# EAGLE design BRUSHLEES (EAGLE 9.6.2)
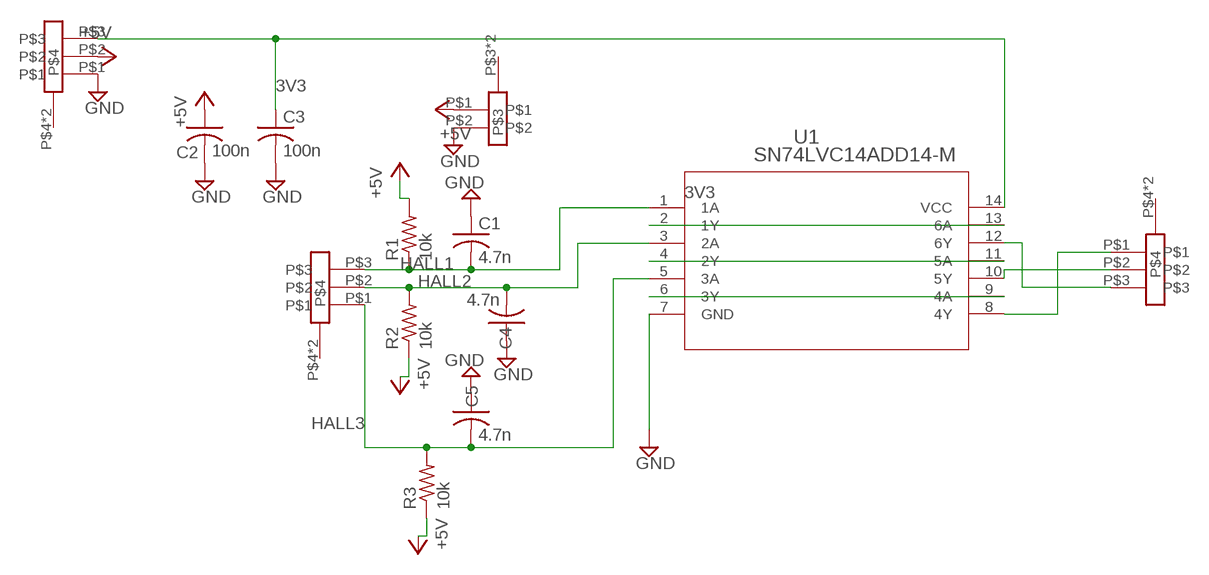
[diagram p0: schematic, sheet 1]

## Parts
ALIMENTACION  PH3  [PH3]
BORN3  PH3  [PH3]
C1  4.7n  C-USC1206K  [C1206K]
C2  100n  C-USC1206K  [C1206K]
C3  100n  C-USC1206K  [C1206K]
C4  4.7n  C-USC1206K  [C1206K]
C5  4.7n  C-USC1206K  [C1206K]
EXT  PH3  [PH3]
R1  10k  R-US_R1206  [R1206]
R2  10k  R-US_R1206  [R1206]
R3  10k  R-US_R1206  [R1206]
U1  SN74LVC14ADD14-M  [D14-M]
U$1  PH2  [PH2]

## Nets
3V3: ALIMENTACION.P$3 C3.1 U1.14(VCC)
+5V: ALIMENTACION.P$2 C2.1 R1.2 R2.1 R3.1 U$1.P$1
GND: ALIMENTACION.P$1 C1.1 C2.2 C3.2 C4.1 C5.1 U1.7(GND) U$1.P$2
HALL1: BORN3.P$3 C1.2 R1.1 U1.1(1A)
HALL2: BORN3.P$2 C4.2 R2.2 U1.3(2A)
HALL3: BORN3.P$1 C5.2 R3.2 U1.5(3A)
N$1: U1.4(2Y) U1.11(5A)
N$2: U1.2(1Y) U1.13(6A)
N$3: U1.6(3Y) U1.9(4A)
N$4: EXT.P$1 U1.8(4Y)
N$5: EXT.P$2 U1.10(5Y)
N$6: EXT.P$3 U1.12(6Y)
Unconnected: ALIMENTACION.P$4 ALIMENTACION.P$5 BORN3.P$4 BORN3.P$5 EXT.P$4 EXT.P$5 U$1.P$3 U$1.P$4

## Library data of the parts
ALIMENTACION BORN3 EXT = MyLib:PH3
C1-C5 = rcl:C-US: CAPACITOR, American symbol; SPICEPREFIX: C
R1-R3 = rcl:R-US_: RESISTOR, American symbol; SPICEPREFIX: R
U1 = RESISTENCIA_MODIFICADA:SN74LVC14AD; COPYRIGHT: Copyright (C) 2024 Ultra Librarian. All rights reserved.; MANUFACTURER_PART_NUMBER: SN74LVC14AD; MFR_NAME: Texas Instruments
U$1 = MyLib:PH2

## Board
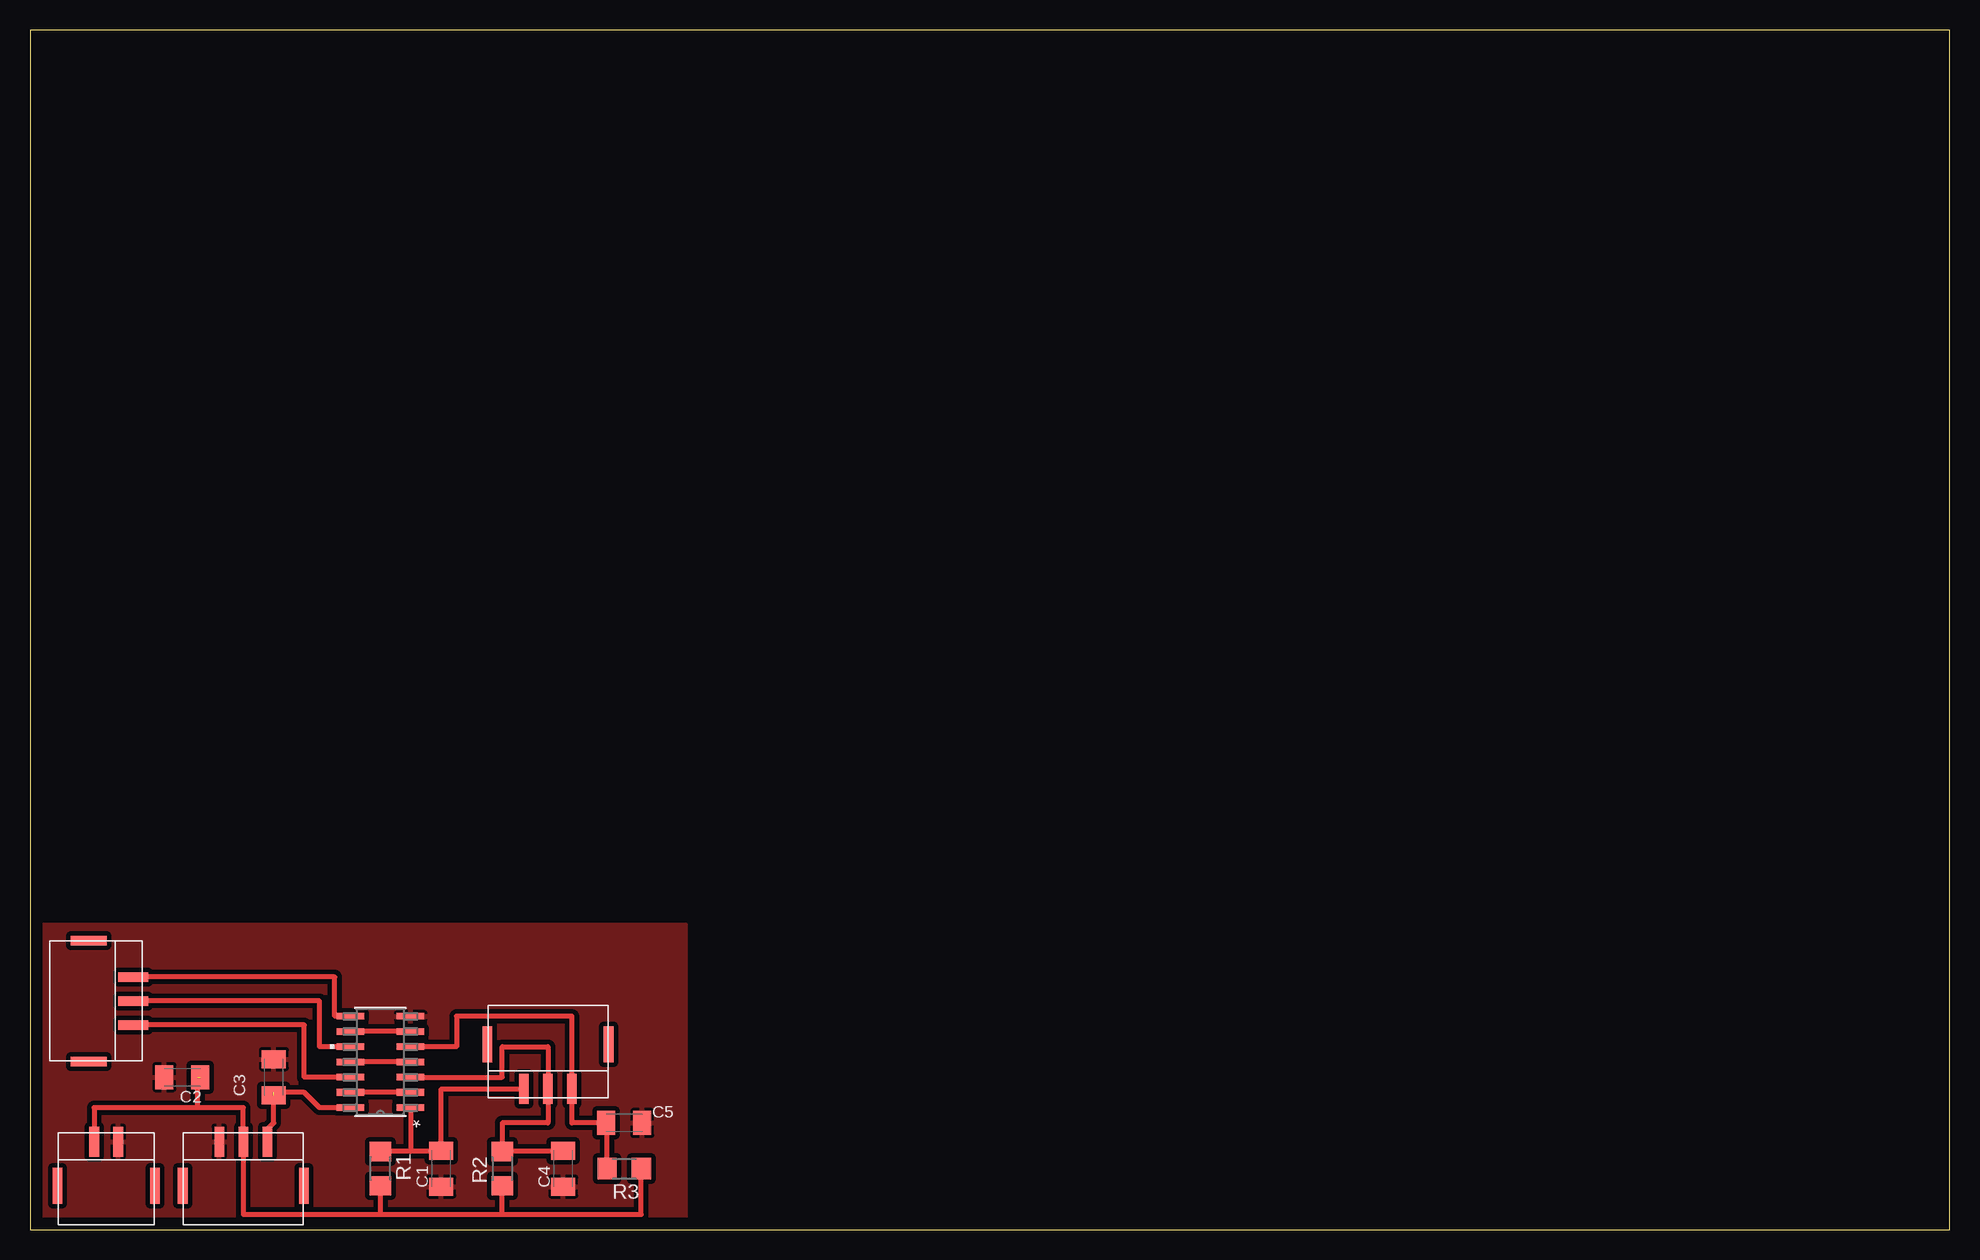
[diagram p1: board, top side]

Size 160 x 100 mm. Coordinates in mm from the lower left corner, seen from the top.
Outline: 0,0 160,0 160,100 0,100 0,0
Copper layers (1*16): Top 0.035mm / dielectric 1.5mm / Bottom 0.035mm
Design rules "default *": minimum track width 6mil, minimum drill 0.35mm, track to track 0.4mm, track to pad 0.4mm, pad to pad 0.4mm, via to via 0.4mm, smd to smd 0.4mm, copper to edge 40mil, drill to drill 6mil, minimum pad ring 10mil, minimum via ring 8mil, stop-mask expansion 4mil, vias tented up to drill 0mil, thermal gap 10mil

### Footprints (pad centres in the part's own frame; a part is rotated, then mirrored left to right if it is on the bottom)
PH3 = smd 0.8 x 2.5: P$1 2,-2.25; P$2 0,-2.25; P$3 -2,-2.25 | smd 0.8 x 3: P$4 -5.05,1.45; P$5 5.05,1.45
C1206K = smd 1.5 x 2: 1 -1.5,0; 2 1.5,0
R1206 = smd 1.6 x 1.803: 1 -1.422,0; 2 1.422,0
D14-M = smd 2.286 x 0.559: 1 -2.515,3.81; 2 -2.515,2.54; 3 -2.515,1.27; 4 -2.515,0; 5 -2.515,-1.27; 6 -2.515,-2.54; 7 -2.515,-3.81; 8 2.515,-3.81; 9 2.515,-2.54; 10 2.515,-1.27; 11 2.515,0; 12 2.515,1.27; 13 2.515,2.54; 14 2.515,3.81
PH2 = smd 0.8 x 2.5: P$1 1,-2.25; P$2 -1,-2.25 | smd 0.8 x 3: P$3 -4.05,1.45; P$4 4.05,1.45

### Placement (x,y rotation side)
ALIMENTACION  17.78,5.08 180 top
BORN3  43.18,13.97 0 top
C1  34.29,5.08 90 top
C2  12.7,12.7 180 top
C3  20.32,12.7 90 top
C4  44.45,5.08 90 top
C5  49.53,8.89 180 top
EXT  6.35,19.05 90 top
R1  29.21,5.08 270 top
R2  39.37,5.08 90 top
R3  49.53,5.08 180 top
U1  29.21,13.97 180 top
U$1  6.35,5.08 180 top

### Tracks (layer width: path | path; a pad name or v marks a point on that pad's centre or on a via)
3V3  (1 unrouted)
  Top 0.406: 19.78,11.43 20.32,11.43 | ALIMENTACION.P$3 19.78,8.35 20.32,8.89 C3.1 20.55,11.43 22.86,11.43 24.13,10.16 U1.14
+5V  (1 unrouted)
  Top 0.406: U$1.P$1 5.35,10.16 13.97,10.16 | 13.97,10.16 17.78,10.16 ALIMENTACION.P$2 17.78,1.27 29.21,1.27 | 13.97,10.16 13.97,12.7 | 29.21,1.27 39.37,1.27 | 39.37,1.27 R2.1 | R3.1 50.95,1.27 39.37,1.27 | 29.21,1.27 R1.2
GND
  pour Top: 0,25.4 54.61,25.4 54.61,1.27 54.61,0 0,0
HALL1
  Top 0.305: 29.21,6.58 R1.1
  Top 0.406: BORN3.P$3 34.29,11.72 C1.2 34.29,6.5 R1.1 31.73,6.5 U1.1
HALL2
  Top 0.406: C4.2 44.45,6.5 R2.2 39.37,8.89 43.18,8.89 BORN3.P$2 43.18,15.24 39.37,15.24 39.37,12.7 U1.3
HALL3
  Top 0.406: U1.5 35.56,15.24 35.56,17.78 45.18,17.78 BORN3.P$1 45.18,8.89 C5.2 48.11,8.89 R3.2
N$1
  Top 0.406: U1.4 U1.11
N$2
  Top 0.406: U1.2 U1.13
N$3
  Top 0.406: U1.6 U1.9
N$4
  Top 0.406: U1.8 25.4,17.78 25.4,21.05 EXT.P$1
N$5
  Top 0.406: U1.10 24.13,15.24 24.13,19.05 EXT.P$2
N$6
  Top 0.406: U1.12 22.86,12.7 22.86,17.05 EXT.P$3